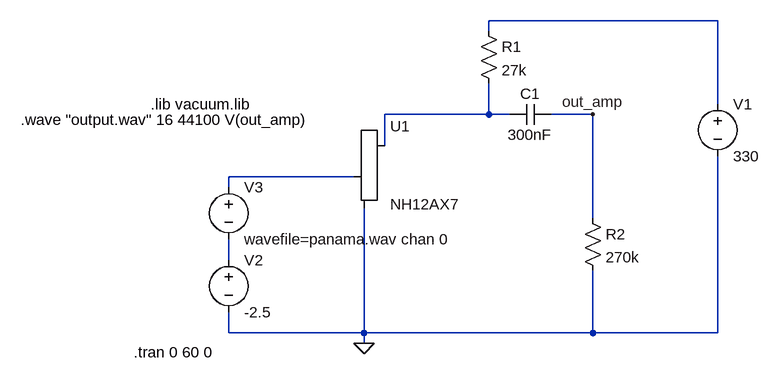
[diagram p0: schematic test.asc]
test.asc, the LTspice schematic file:
Version 4
SHEET 1 880 680
WIRE 752 -96 400 -96
WIRE 400 -80 400 -96
WIRE 752 32 752 -96
WIRE 400 48 400 0
WIRE 400 48 240 48
WIRE 432 48 400 48
WIRE 560 48 496 48
WIRE 240 96 240 48
WIRE 192 144 0 144
WIRE 0 160 0 144
WIRE 560 208 560 48
WIRE 0 272 0 240
WIRE 0 384 0 352
WIRE 208 384 208 192
WIRE 208 384 0 384
WIRE 560 384 560 288
WIRE 560 384 208 384
WIRE 752 384 752 112
WIRE 752 384 560 384
WIRE 208 400 208 384
FLAG 208 400 0
FLAG 560 48 out_amp
SYMBOL Misc\\triode 240 144 R0
SYMATTR InstName U1
SYMATTR Value NH12AX7
SYMATTR SpiceLine X1 A G K NH12AX7
SYMBOL voltage 752 16 R0
WINDOW 123 0 0 Left 0
WINDOW 39 0 0 Left 0
SYMATTR InstName V1
SYMATTR Value 330
SYMBOL voltage 0 256 R0
WINDOW 123 0 0 Left 0
WINDOW 39 0 0 Left 0
SYMATTR InstName V2
SYMATTR Value -2.5
SYMBOL res 384 -96 R0
SYMATTR InstName R1
SYMATTR Value 27k
SYMBOL cap 496 32 R90
WINDOW 0 0 32 VBottom 2
WINDOW 3 32 32 VTop 2
SYMATTR InstName C1
SYMATTR Value 300nF
SYMBOL res 544 192 R0
SYMATTR InstName R2
SYMATTR Value 270k
SYMBOL voltage 0 144 R0
WINDOW 123 0 0 Left 0
WINDOW 39 0 0 Left 0
SYMATTR InstName V3
SYMATTR Value wavefile=panama.wav chan 0
TEXT -120 32 Left 2 !.lib vacuum.lib
TEXT -146 414 Left 2 !.tran 0 60 0
TEXT -320 56 Left 2 !.wave "output.wav" 16 44100 V(out_amp)

The netlist it stands for:
* test.asc
XU1 N002 N003 0 NH12AX7 X1 A G K NH12AX7
V1 N001 0 330
V2 N004 0 -2.5
R1 N001 N002 27k
C1 out_amp N002 300nF
R2 out_amp 0 270k
V3 N003 N004 wavefile=panama.wav chan 0
.lib vacuum.lib
.tran 0 60 0
.wave "output.wav" 16 44100 V(out_amp)
.backanno
.end